# Altium schematic sheet PP5_Contrôles.SchDoc
size 199 x 200 mm
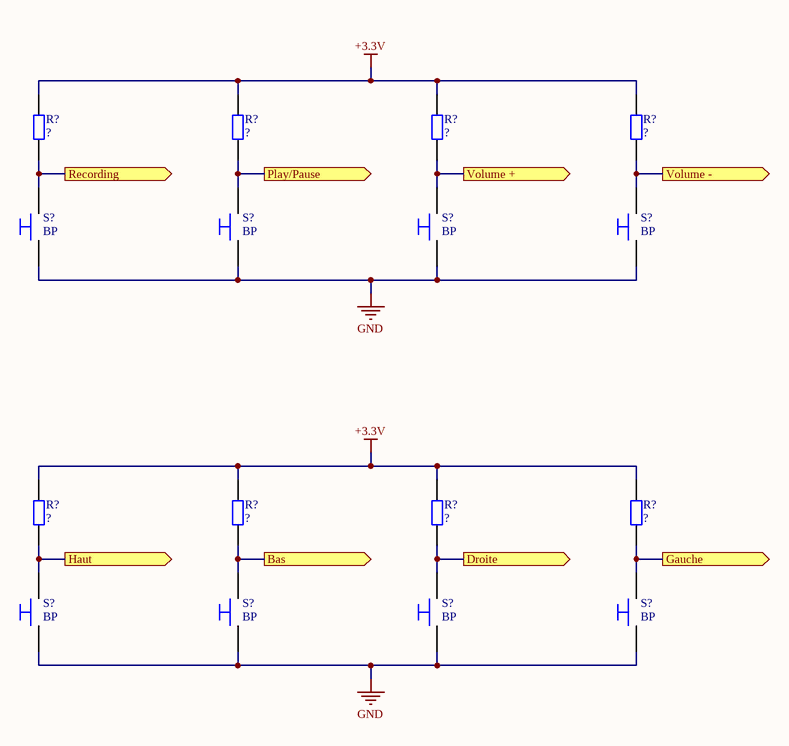
[diagram p0: PP5_Contrôles.SchDoc]

## Parts
(Parts that share a designator on the sheet are numbered #1, #2 ... from top to bottom, then left to right.)
R?#1  Res  (value not drawn)  (no BOM)
R?#2  Res  (value not drawn)  (no BOM)
R?#3  Res  (value not drawn)  (no BOM)
R?#4  Res  (value not drawn)  (no BOM)
R?#5  Res  (value not drawn)  (no BOM)
R?#6  Res  (value not drawn)  (no BOM)
R?#7  Res  (value not drawn)  (no BOM)
R?#8  Res  (value not drawn)  (no BOM)
S?#1  BP  (no BOM)
S?#2  BP  (no BOM)
S?#3  BP  (no BOM)
S?#4  BP  (no BOM)
S?#5  BP  (no BOM)
S?#6  BP  (no BOM)
S?#7  BP  (no BOM)
S?#8  BP  (no BOM)

## Ports
Bas (out), Droite (out), Gauche (out), Haut (out), Play/Pause (out), Recording (out), Volume + (out), Volume - (out)

## Nets
+3.3V: R?#1.2 R?#2.2 R?#3.2 R?#4.2 R?#5.2 R?#6.2 R?#7.2 R?#8.2
GND: S?#1.1 S?#2.1 S?#3.1 S?#4.1 S?#5.1 S?#6.1 S?#7.1 S?#8.1
Bas: R?#6.1 S?#6.2 ; port Bas
Droite: R?#7.1 S?#7.2 ; port Droite
Gauche: R?#8.1 S?#8.2 ; port Gauche
Haut: R?#5.1 S?#5.2 ; port Haut
Play/Pause: R?#2.1 S?#2.2 ; port Play/Pause
Recording: R?#1.1 S?#1.2 ; port Recording
Volume +: R?#3.1 S?#3.2 ; port Volume +
Volume -: R?#4.1 S?#4.2 ; port Volume -

## Library data of the parts
R?#1-R?#8 = Res: Résistance; Valeur: ?
S?#1-S?#8 = BP: Bouton Poussoir